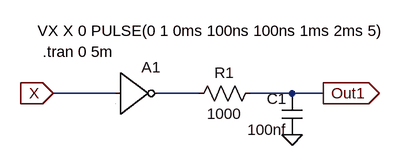
[diagram p0: schematic Lab2part1.asc]
Lab2part1.asc, the LTspice schematic file:
Version 4
SHEET 1 880 680
WIRE 144 128 48 128
WIRE 272 128 208 128
WIRE 416 128 352 128
WIRE 464 128 416 128
FLAG 48 128 X
IOPIN 48 128 In
FLAG 416 192 0
FLAG 464 128 Out1
IOPIN 464 128 Out
SYMBOL Digital\\inv 144 64 R0
SYMATTR InstName A1
SYMBOL res 368 112 R90
WINDOW 0 0 56 VBottom 2
WINDOW 3 32 56 VTop 2
SYMATTR InstName R1
SYMATTR Value 1000
SYMBOL cap 432 192 R180
WINDOW 0 24 56 Left 2
WINDOW 3 24 8 Left 2
SYMATTR InstName C1
SYMATTR Value 100nf
TEXT 24 32 Left 2 !VX X 0 PULSE(0 1 0ms 100ns 100ns 1ms 2ms 5)
TEXT 32 64 Left 2 !.tran 0 5m

The netlist it stands for:
* Lab2part1.asc
A1 X 0 0 0 0 N001 0 0 BUF
R1 Out1 N001 1000
C1 0 Out1 100nf
VX X 0 PULSE(0 1 0ms 100ns 100ns 1ms 2ms 5)
.tran 0 5m
.backanno
.end